# Altium schematic sheet Support.SchDoc: Arm - Support
size Letter; DrawnBy: N.Chapman, K.Hong; Organization: UW Robotics; Address1: 200 University Avenue; Address2: Waterloo; Address3: Ontario; Address4: Canada N2L 3G6; SheetNumber: 6; SheetTotal: 9
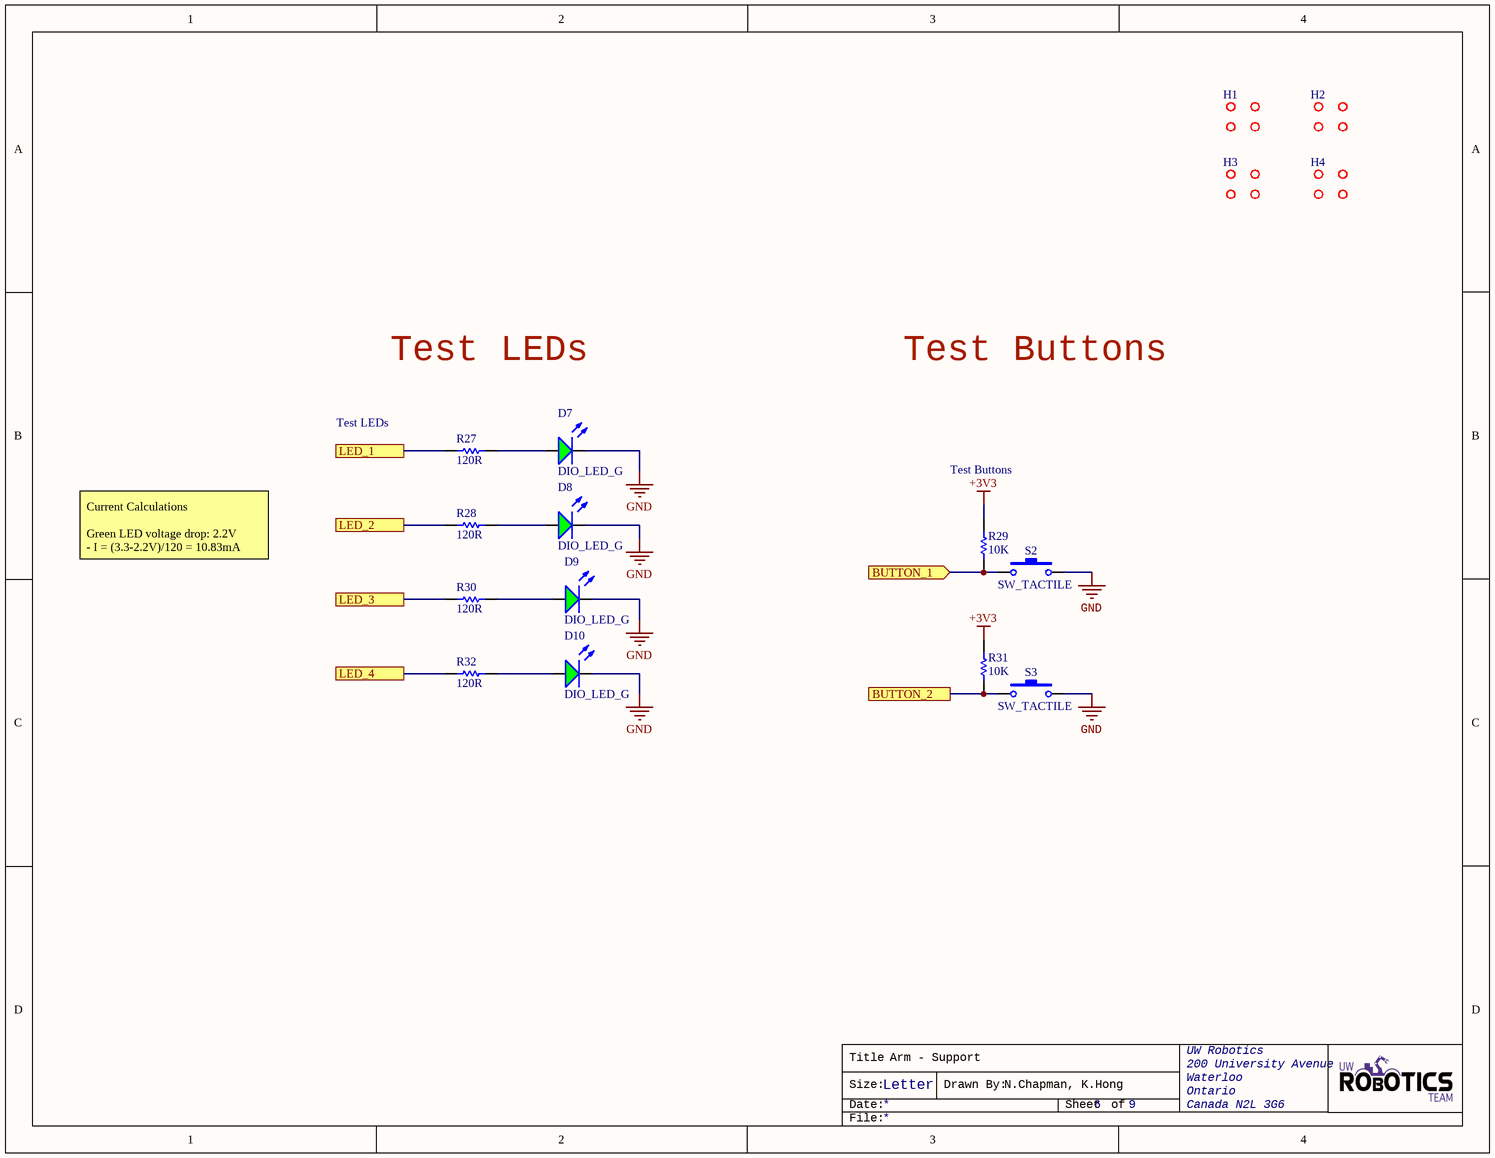
[diagram p0: Support.SchDoc]

## Parts
D7  DIO_LED_G  [LED_0805_LINE]
D8  DIO_LED_G  [LED_0805_LINE]
D9  DIO_LED_G  [LED_0805_LINE]
D10  DIO_LED_G  [LED_0805_LINE]
H1  MOUNTING_HOLES  [MOUNTING_HOLE]  (value not drawn)
H2  MOUNTING_HOLES  [MOUNTING_HOLE]  (value not drawn)
H3  MOUNTING_HOLES  [MOUNTING_HOLE]  (value not drawn)
H4  MOUNTING_HOLES  [MOUNTING_HOLE]  (value not drawn)
R27  value 120R  [RESC0603(1608)_N]  (hidden comment: RES_120R_0603)
R28  value 120R  [RESC0603(1608)_N]  (hidden comment: RES_120R_0603)
R29  value 10K  [RESC0603(1608)_N]  (hidden comment: RES_10K_0603)
R30  value 120R  [RESC0603(1608)_N]  (hidden comment: RES_120R_0603)
R31  value 10K  [RESC0603(1608)_N]  (hidden comment: RES_10K_0603)
R32  value 120R  [RESC0603(1608)_N]  (hidden comment: RES_120R_0603)
S2  SW_TACTILE  [B3U-1100P]
S3  SW_TACTILE  [B3U-1100P]

## Ports
BUTTON_1 (in), BUTTON_2, LED_1, LED_2, LED_3, LED_4

## Nets
+3V3: R29.2 R31.2
GND: D7.2(K) D8.2(K) D9.2(K) D10.2(K) S2.2 S3.2
BUTTON_1: R29.1 S2.1 ; port BUTTON_1
BUTTON_2: R31.1 S3.1 ; port BUTTON_2
LED_1: R27.1 ; port LED_1
LED_2: R28.1 ; port LED_2
LED_3: R30.1 ; port LED_3
LED_4: R32.1 ; port LED_4
NetD7_1: D7.1(A) R27.2
NetD8_1: D8.1(A) R28.2
NetD9_1: D9.1(A) R30.2
NetD10_1: D10.1(A) R32.2

## Notes on the sheet
- Test LEDs
- Test Buttons
- Current Calculations
  Green LED voltage drop: 2.2V
  - I = (3.3-2.2V)/120 = 10.83mA
- Title
- Size:
- Date:
- Letter
- Drawn By:
- Sheet
- of
- File:

## Library data of the parts
D7-D10 = DIO_LED_G: LED GREEN DIFFUSED 0805 SMD; Manufacturer: OSRAM; MPN: LG R971-KN-1; Forward Voltage Drop: 2.2V; Package: 0805 (2012 Metric); Supplier Part Number 1: 475-1410-1-ND; Supplier 1: Digi-Key
H1-H4 = MOUNTING_HOLES: 6cm x 6cm
R27 R28 R30 R32 = RES_120R_0603: RES SMD 120 OHM 5% 1/10W 0603; Manufacturer: Yageo; MPN: RC0603JR-07120RL; Package: 0603 (1608 Metric); Dimensions: 0.063" L x 0.031" W (1.60mm x 0.80mm); Tolerance: 5%; Supplier Part Number 1: 311-120GRCT-ND; Supplier 1: Digi-Key
R29 R31 = RES_10K_0603: RES SMD 10K OHM 5% 1/10W 0603; Manufacturer: Yageo; MPN: RC0603JR-0710KL; Package: 0603 (1608 Metric); Dimensions: 0.063" L x 0.031" W (1.60mm x 0.80mm); Tolerance: 5%; Supplier Part Number 1: 311-10KGRCT-ND; Supplier 1: Digi-Key
S2 S3 = SW_TACTILE: Tactile Switch (Grey); Manufacturer: Omron Electronics Inc-EMC Div; MPN: B3U-1100P; Supplier Part Number 1: SW1021TR-ND; Supplier 1: Digi-Key